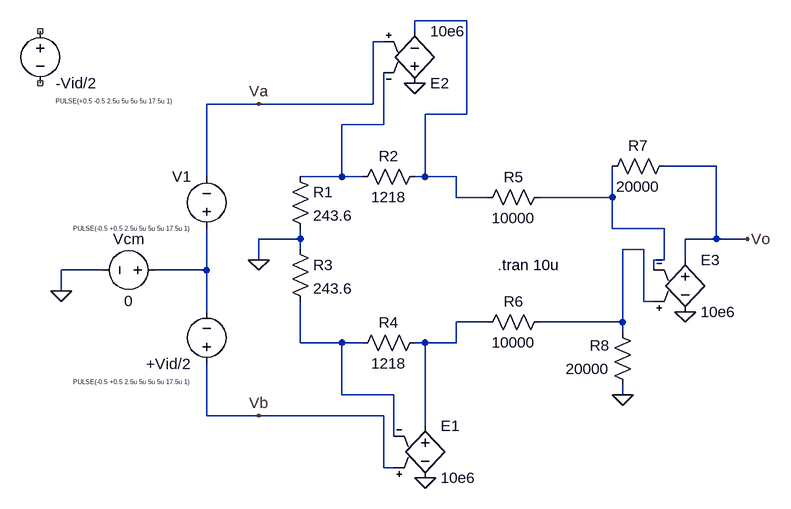
[diagram p0: schematic Spice1_1_gen.asc]
Spice1_1_gen.asc, the LTspice schematic file:
Version 4
SHEET 1 920 736
WIRE 288 -48 208 -48
WIRE 208 -32 208 -48
WIRE 160 -16 144 -16
WIRE -32 80 -112 80
WIRE 144 80 144 -16
WIRE 144 80 -32 80
WIRE 288 96 288 -48
WIRE 288 96 224 96
WIRE 160 112 160 32
WIRE 160 112 96 112
WIRE 672 176 592 176
WIRE -112 192 -112 80
WIRE 96 192 96 112
WIRE 96 192 32 192
WIRE 128 192 96 192
WIRE 224 192 224 96
WIRE 224 192 208 192
WIRE 272 192 224 192
WIRE 272 224 272 192
WIRE 320 224 272 224
WIRE 512 224 512 176
WIRE 512 224 400 224
WIRE 512 272 512 224
WIRE 592 272 512 272
WIRE 32 288 32 272
WIRE 32 288 -32 288
WIRE 672 288 672 176
WIRE 672 288 624 288
WIRE 720 288 672 288
WIRE 32 304 32 288
WIRE 560 304 528 304
WIRE -32 320 -32 288
WIRE 592 320 592 272
WIRE 592 320 576 320
WIRE 624 320 624 288
WIRE -272 336 -336 336
WIRE -112 336 -112 272
WIRE -112 336 -192 336
WIRE 576 336 576 320
WIRE -336 368 -336 336
WIRE 560 384 560 304
WIRE 576 384 560 384
WIRE -112 400 -112 336
WIRE 320 416 272 416
WIRE 528 416 528 304
WIRE 528 416 400 416
WIRE 528 432 528 416
WIRE 32 448 32 384
WIRE 96 448 32 448
WIRE 128 448 96 448
WIRE 224 448 208 448
WIRE 272 448 272 416
WIRE 272 448 224 448
WIRE 96 528 96 448
WIRE 176 528 96 528
WIRE 528 528 528 512
WIRE -112 560 -112 480
WIRE -32 560 -112 560
WIRE 160 560 -32 560
WIRE 224 576 224 448
WIRE 176 592 176 528
WIRE 160 640 160 560
WIRE 176 640 160 640
FLAG 528 528 0
FLAG -32 320 0
FLAG -336 368 0
FLAG -32 560 Vb
FLAG 720 288 Vo
FLAG 624 400 0
FLAG 224 656 0
FLAG 208 48 0
FLAG -32 80 Va
SYMBOL res 16 176 R0
SYMATTR InstName R1
SYMATTR Value 243.6
SYMBOL res 224 176 R90
WINDOW 0 0 56 VBottom 2
WINDOW 3 32 56 VTop 2
SYMATTR InstName R2
SYMATTR Value 1218
SYMBOL res 16 288 R0
SYMATTR InstName R3
SYMATTR Value 243.6
SYMBOL res 224 432 R90
WINDOW 0 0 56 VBottom 2
WINDOW 3 32 56 VTop 2
SYMATTR InstName R4
SYMATTR Value 1218
SYMBOL res 416 208 R90
WINDOW 0 0 56 VBottom 2
WINDOW 3 32 56 VTop 2
SYMATTR InstName R5
SYMATTR Value 10000
SYMBOL res 416 400 R90
WINDOW 0 0 56 VBottom 2
WINDOW 3 32 56 VTop 2
SYMATTR InstName R6
SYMATTR Value 10000
SYMBOL res 608 160 R90
WINDOW 0 0 56 VBottom 2
WINDOW 3 32 56 VTop 2
SYMATTR InstName R7
SYMATTR Value 20000
SYMBOL res 544 528 R180
WINDOW 0 36 76 Left 2
WINDOW 3 36 40 Left 2
SYMATTR InstName R8
SYMATTR Value 20000
SYMBOL voltage -112 496 R180
WINDOW 3 24 -12 Left 0
WINDOW 123 0 0 Left 0
WINDOW 39 0 0 Left 0
SYMATTR Value PULSE(-0.5 +0.5 2.5u 5u 5u 5u 17.5u 1)
SYMATTR InstName +Vid/2
SYMBOL voltage -368 -48 R0
WINDOW 0 24 96 Left 2
WINDOW 3 24 124 Left 0
WINDOW 123 0 0 Left 0
WINDOW 39 0 0 Left 0
SYMATTR InstName -Vid/2
SYMATTR Value PULSE(+0.5 -0.5 2.5u 5u 5u 5u 17.5u 1)
SYMBOL voltage -176 336 R90
WINDOW 0 -32 56 VBottom 2
WINDOW 3 32 56 VTop 2
SYMATTR InstName Vcm
SYMATTR Value 0
SYMBOL voltage -112 288 R180
WINDOW 0 24 96 Left 2
WINDOW 3 24 16 Left 0
WINDOW 123 0 0 Left 0
WINDOW 39 0 0 Left 0
SYMATTR InstName V1
SYMATTR Value PULSE(-0.5 +0.5 2.5u 5u 5u 5u 17.5u 1)
SYMBOL e2 224 560 R0
SYMATTR InstName E1
SYMATTR Value 10e6
SYMBOL e2 208 64 M180
SYMATTR InstName E2
SYMATTR Value 10e6
SYMBOL e2 624 304 R0
SYMATTR InstName E3
SYMATTR Value 10e6
TEXT 336 328 Left 2 !.tran 10u

The netlist it stands for:
* Spice1_1_gen.asc
R1 N002 0 243.6
R2 N001 N002 1218
R3 0 N007 243.6
R4 N006 N007 1218
R5 N003 N001 10000
R6 N004 N006 10000
R7 Vo N003 20000
R8 0 N004 20000
V§+Vid/2 Vb N005 PULSE(-0.5 +0.5 2.5u 5u 5u 5u 17.5u 1)
V§-Vid/2 NC_01 NC_02 PULSE(+0.5 -0.5 2.5u 5u 5u 5u 17.5u 1)
Vcm N005 0 0
V1 N005 Va PULSE(-0.5 +0.5 2.5u 5u 5u 5u 17.5u 1)
E1 N006 0 Vb N007 10e6
E2 0 N001 Va N002 10e6
E3 Vo 0 N004 N003 10e6
.tran 10u
.backanno
.end